# EAGLE schematic arduino (EAGLE 9.6.2)
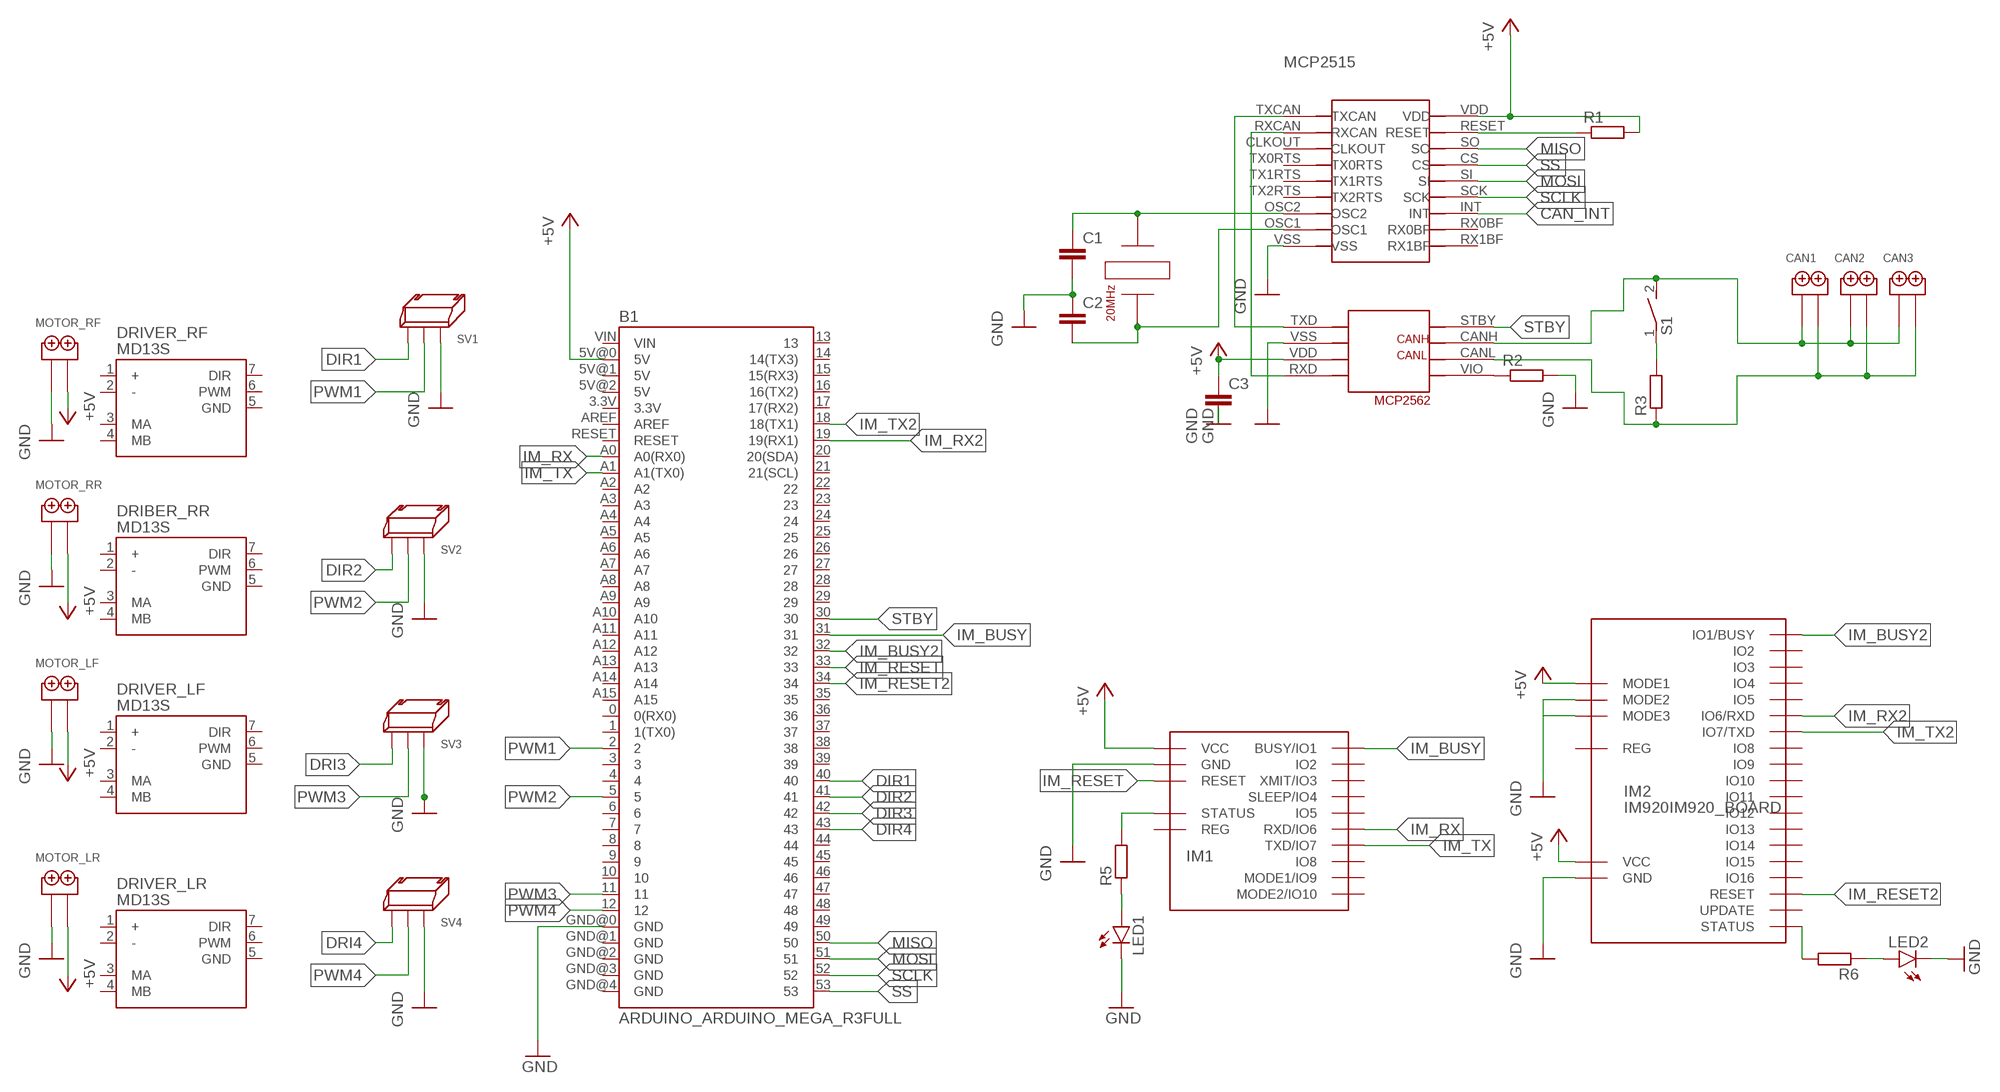
[diagram p0: schematic, sheet 1]

## Parts
B1  ARDUINO_ARDUINO_MEGA_R3FULL  [ARDUINO_ARDUINO_MEGA]
C1  C-EU025-024X044  [C025-024X044]
C2  C-EU025-024X044  [C025-024X044]
C3  C-EU025-024X044  [C025-024X044]
CAN1  2PIN  [2PIN]
CAN2  2PIN  [2PIN]
CAN3  2PIN  [2PIN]
DRIBER_RR  MD13S  [MD13S]
DRIVER_LF  MD13S  [MD13S]
DRIVER_LR  MD13S  [MD13S]
DRIVER_RF  MD13S  [MD13S]
IM1  IM920C  [IM920C]
IM2  IM920IM920_BOARD  [IM920_BOARD]
LED1  LED3MM  [LED3MM]
LED2  LED3MM  [LED3MM]
MCP2  MCP2515  [MCP2515]
MOTOR_LF  2PIN  [2PIN]
MOTOR_LR  2PIN  [2PIN]
MOTOR_RF  2PIN  [2PIN]
MOTOR_RR  2PIN  [2PIN]
R1  R-EU_0207/10  [0207/10]
R2  R-EU_0207/10  [0207/10]
R3  R-EU_0207/10  [0207/10]
R5  R-EU_0207/10  [0207/10]
R6  R-EU_0207/10  [0207/10]
S1  DS01E  [DS-01]
SV1  3PIN_SIDE  [3PIN_SIDE]
SV2  3PIN_SIDE  [3PIN_SIDE]
SV3  3PIN_SIDE  [3PIN_SIDE]
SV4  3PIN_SIDE  [3PIN_SIDE]
U$1  MCP2562  [MCP2562]
U$3  HUSG20  [HUSG20]

## Nets
+5V: B1.5V@0(5V) C3.1 IM1.$P17(VCC) IM2.IO17(MODE1) IM2.IO23(VCC) MCP2.VDD MOTOR_LF.P$2 MOTOR_LR.P$2 MOTOR_RF.P$2 MOTOR_RR.P$2 R1.2 U$1.VDD
CAN_INT: MCP2.INT
DIR1: B1.40 SV1.P$2
DIR2: B1.41 SV2.P$2
DIR3: B1.42
DIR4: B1.43
DRI3: SV3.P$2
DRI4: SV4.P$2
GND: B1.GND@0(GND) LED1.K(C) LED2.K(C) R2.2
IM_BUSY: B1.31 IM1.$P1(BUSY/IO1)
IM_BUSY2: B1.32 IM2.IO1(IO1/BUSY)
IM_RESET: B1.33 IM1.$P19(RESET)
IM_RESET2: B1.34 IM2.IO25(RESET)
IM_RX: B1.A0(A0(RX0)) IM1.$P6(RXD/IO6)
IM_RX2: B1.19(19(RX1)) IM2.IO6(IO6/RXD)
IM_TX: B1.A1(A1(TX0)) IM1.$P7(TXD/IO7)
IM_TX2: B1.18(18(TX1)) IM2.IO7(IO7/TXD)
MISO: B1.50 MCP2.SO
MOSI: B1.51 MCP2.SI
N$1: C1.1 MCP2.OSC2 U$3.A
N$2: C2.2 MCP2.OSC1 U$3.B
N$3: MCP2.TXCAN U$1.TXD
N$4: MCP2.RXCAN U$1.RXD
N$5: MCP2.RESET R1.1
N$6: R2.1 U$1.VIO
N$7: CAN1.P$1 CAN2.P$1 CAN3.P$1 S1.2 U$1.CANH
N$8: R3.2 S1.1
N$10: IM2.IO19(MODE3)
N$11: CAN1.P$2 CAN2.P$2 CAN3.P$2 R3.1 U$1.CANL
N$13: LED1.A R5.1
N$14: IM2.IO21(STATUS) R6.2
N$15: LED2.A R6.1
N$16: IM1.$P15(STATUS) R5.2
PWM1: B1.2 SV1.P$1
PWM2: B1.5 SV2.P$1
PWM3: B1.11 SV3.P$1
PWM4: B1.12 SV4.P$1
SCLK: B1.52 MCP2.SCK
SS: B1.53 MCP2.CS
STBY: B1.30 U$1.STBY
V-: C1.2 C2.1 C3.2 IM1.$P18(GND) IM2.IO18(MODE2) IM2.IO24(GND) MCP2.VSS MOTOR_LF.P$1 MOTOR_LR.P$1 MOTOR_RF.P$1 MOTOR_RR.P$1 SV1.P$3 SV2.P$3 SV3.P$3 SV4.P$3 U$1.VSS ; supply symbol labelled GND
Unconnected: B1.0(0(RX0)) B1.1(1(TX0)) B1.3 B1.3.3V B1.4 B1.5V@1(5V) B1.5V@2(5V) B1.6 B1.7 B1.8 B1.9 B1.10 B1.13 B1.14(14(TX3)) B1.15(15(RX3)) B1.16(16(TX2)) B1.17(17(RX2)) B1.20(20(SDA)) B1.21(21(SCL)) B1.22 B1.23 B1.24 B1.25 B1.26 B1.27 B1.28 B1.29 B1.35 B1.36 B1.37 B1.38 B1.39 B1.44 B1.45 B1.46 B1.47 B1.48 B1.49 B1.A2 B1.A3 B1.A4 B1.A5 B1.A6 B1.A7 B1.A8 B1.A9 B1.A10 B1.A11 B1.A12 B1.A13 B1.A14 B1.A15 B1.AREF B1.GND@1(GND) B1.GND@2(GND) B1.GND@3(GND) B1.GND@4(GND) B1.RESET B1.VIN DRIBER_RR.1(+) DRIBER_RR.2(-) DRIBER_RR.3(MA) DRIBER_RR.4(MB) DRIBER_RR.5(GND) DRIBER_RR.6(PWM) DRIBER_RR.7(DIR) DRIVER_LF.1(+) DRIVER_LF.2(-) DRIVER_LF.3(MA) DRIVER_LF.4(MB) DRIVER_LF.5(GND) DRIVER_LF.6(PWM) DRIVER_LF.7(DIR) DRIVER_LR.1(+) DRIVER_LR.2(-) DRIVER_LR.3(MA) DRIVER_LR.4(MB) DRIVER_LR.5(GND) DRIVER_LR.6(PWM) DRIVER_LR.7(DIR) DRIVER_RF.1(+) DRIVER_RF.2(-) DRIVER_RF.3(MA) DRIVER_RF.4(MB) DRIVER_RF.5(GND) DRIVER_RF.6(PWM) DRIVER_RF.7(DIR) IM1.$P2(IO2) IM1.$P3(XMIT/IO3) IM1.$P4(SLEEP/IO4) IM1.$P5(IO5) IM1.$P8(IO8) IM1.$P9(MODE1/IO9) IM1.$P10(MODE2/IO10) IM1.$P16(REG) IM2.IO2 IM2.IO3 IM2.IO4 IM2.IO5 IM2.IO8 IM2.IO9 IM2.IO10 IM2.IO11 IM2.IO12 IM2.IO13 IM2.IO14 IM2.IO15 IM2.IO16 IM2.IO20(UPDATE) IM2.IO22(REG) MCP2.CLKOUT MCP2.RX0BF MCP2.RX1BF MCP2.TX0RTS MCP2.TX1RTS MCP2.TX2RTS

## Library data of the parts
B1 = ArduinoMega:ARDUINO_ARDUINO_MEGA_R3: Arduino Mega R3 ATmega2560 R3 compatible footprint. SparkFun Products: Arduino Mega 2560 R3 <https://www.sparkfun.com/products/11061>
C1-C3 = rcl:C-EU: CAPACITOR, European symbol; SPICEPREFIX: C
CAN1-CAN3 MOTOR_LF MOTOR_LR MOTOR_RF MOTOR_RR = TB113-2B-x-x-0-x-x:2PIN
DRIBER_RR DRIVER_LF DRIVER_LR DRIVER_RF = Module:MD13S: 13Amp DC Motor Driver (MD13S) Created by: Wai Weng; CYTRON-PC: MD13S; DESC: 13Amp DC Motor Driver - GROVE Compatible; MF: Cytron; MPN: MD13S
IM1 = IM920:IM920C
IM2 = IM920:IM920
LED1 LED2 = led:LED: LED OSRAM: - CHIPLED LG R971, LG N971, LY N971, LG Q971, LY Q971, LO R971, LY R971 LH N974, LH R974 LS Q976, LO Q976, LY Q976 LO Q996 - Hyper CHIPLED LW Q18S LB Q993, LB Q99A, LB R99A - SideLED LS A670, LO A670, LY A670, LG A670, LP A670 LB A673, LV A673, LT A673, LW A673 LH A674 LY A675 LS A676, LA A676, LO A676, LY A676, LW A676 LS A679, LY A679, LG A679 - Hyper Micro SIDELED® LS Y876, LA Y876, LO Y876, LY Y876 LT Y87S - SmartLED LW L88C, LW L88S LB L89C, LB L89S, LG L890 LS L89K, LO L89K, LY L89K LS L896, LA L896, LO L896, LY L896 - TOPLED LS T670, LO T670, LY T670, LG T670, LP T670 LSG T670, LSP T670, LSY T670, LOP T670, LYG T670 LG T671, LOG T671, LSG T671 LB T673, LV T673, LT T673, LW T673 LH T674 LS T676, LA T676, LO T676, LY T676, LB T676, LH T676, LSB T676, LW T676 LB T67C, LV T67C, LT T67C, LS T67K, LO T67K, LY T67K, LW E67C LS E67B, LA E67B, LO E67B, LY E67B, LB E67C, LV E67C, LT E67C LW T67C LS T679, LY T679, LG T679 LS T770, LO T770, LY T770, LG T770, LP T770 LB T773, LV T773, LT T773, LW T773 LH T774 LS E675, LA E675, LY E675, LS T675 LS T776, LA T776, LO T776, LY T776, LB T776 LHGB T686 LT T68C, LB T68C - Hyper Mini TOPLED® LB M676 - Mini TOPLED Santana® LG M470 LS M47K, LO M47K, LY M47K Source: http://www.osram.convergy.de LUXEON: - LUMILED® LXK2-PW12-R00, LXK2-PW12-S00, LXK2-PW14-U00, LXK2-PW14-V00 LXK2-PM12-R00, LXK2-PM12-S00, LXK2-PM14-U00 LXK2-PE12-Q00, LXK2-PE12-R00, LXK2-PE12-S00, LXK2-PE14-T00, LXK2-PE14-U00 LXK2-PB12-K00, LXK2-PB12-L00, LXK2-PB12-M00, LXK2-PB14-N00, LXK2-PB14-P00, LXK2-PB14-Q00 LXK2-PR12-L00, LXK2-PR12-M00, LXK2-PR14-Q00, LXK2-PR14-R00 LXK2-PD12-Q00, LXK2-PD12-R00, LXK2-PD12-S00 LXK2-PH12-R00, LXK2-PH12-S00 LXK2-PL12-P00, LXK2-PL12-Q00, LXK2-PL12-R00 Source: www.luxeon.com KINGBRIGHT: KA-3528ASYC Source: www.kingbright.com
MCP2 = MCP2515:MCP2515
R1-R3 R5 R6 = rcl:R-EU_: RESISTOR, European symbol; SPICEPREFIX: R
S1 = switch-dil:DS01E: DIL/CODE SWITCH; OC_FARNELL: unknown; OC_NEWARK: unknown
SV1-SV4 = XR Connector:3PIN_SIDE
U$1 = MCP2562:MCP2562
U$3 = HUSG20:HUSG20

## Net classes
0 default: width 0.61 mm
1 power: width 0.914 mm, clearance 0.508 mm